# Altium schematic sheet mic_usb_assy.SchDoc
size A4
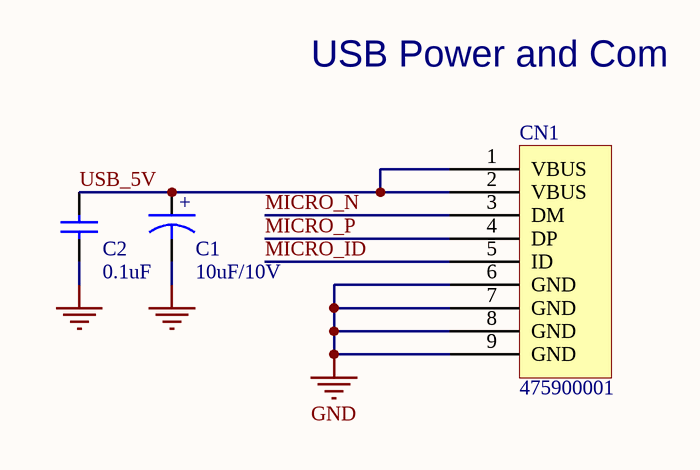
[diagram p0: mic_usb_assy.SchDoc]

## Parts
C1  10uF/10V  [3216]
C2  0.1uF  [0402C]
CN1  475900001  [MICRO-USB-乐沪]

## Nets
GND: C1.2 C2.1 CN1.6(GND) CN1.7(GND) CN1.8(GND) CN1.9(GND)
MICRO_ID: CN1.5(ID)
MICRO_N: CN1.3(DM)
MICRO_P: CN1.4(DP)
USB_5V: C1.1 C2.2 CN1.1(VBUS) CN1.2(VBUS)

## Notes on the sheet
- USB Power and Com
- (in symbol Capacitor) +

## Library data of the parts
C1 = Capacitor
C2 = Cap: Published: 8-Jun-2000; Revision: July-2002: Re-released for DXP Platform.; Publisher: Altium Limited
CN1 = 475900001: Manuf_1: MOLEX; Ordered by: Subcon; Silkscreen: USB USER; Manuf_Part_1: 475900001